# Altium schematic sheet PowerSupply.SchDoc
size A3; Organization: Altium Limited; Address1: L3, 12a Rodborough Rd; Address2: Frenchs Forest; Address3: NSW; Address4: Australia 2086
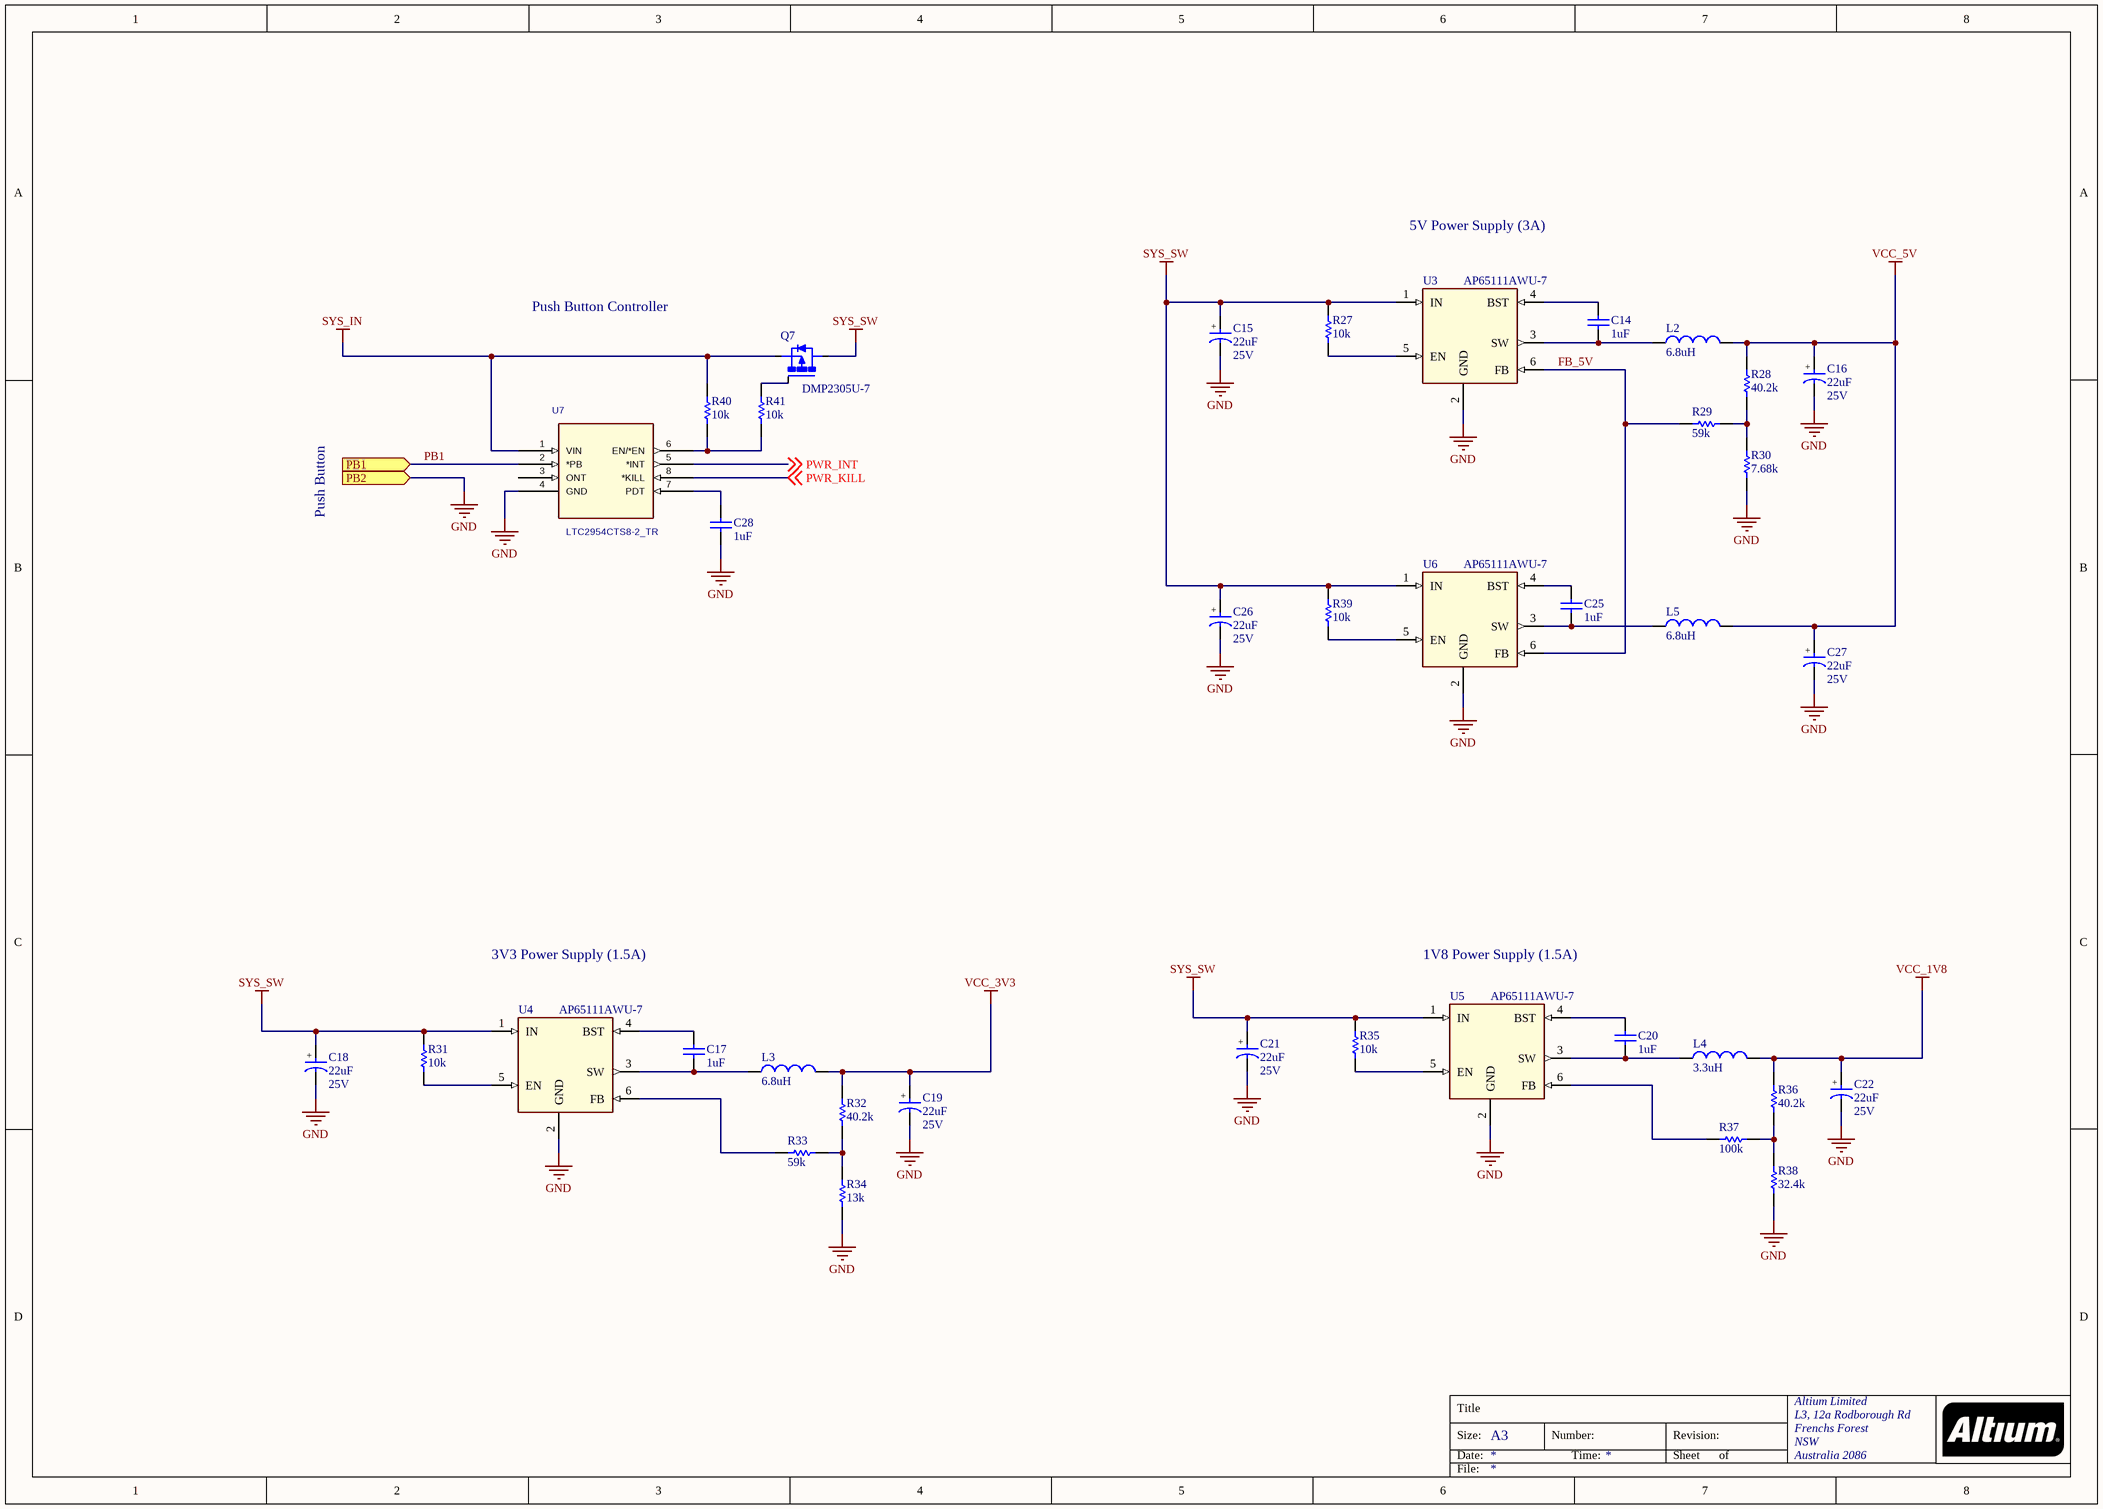
[diagram p0: PowerSupply.SchDoc]

## Parts
C14  value 1uF  [C0603]  (hidden comment: CAP)
C15  value 22uF  Voltage: 25V  [CASE-A]  (hidden comment: CAP-P)
C16  value 22uF  Voltage: 25V  [CASE-A]  (hidden comment: CAP-P)
C17  value 1uF  [C0603]  (hidden comment: CAP)
C18  value 22uF  Voltage: 25V  [CASE-A]  (hidden comment: CAP-P)
C19  value 22uF  Voltage: 25V  [CASE-A]  (hidden comment: CAP-P)
C20  value 1uF  [C0603]  (hidden comment: CAP)
C21  value 22uF  Voltage: 25V  [CASE-A]  (hidden comment: CAP-P)
C22  value 22uF  Voltage: 25V  [CASE-A]  (hidden comment: CAP-P)
C25  value 1uF  [C0603]  (hidden comment: CAP)
C26  value 22uF  Voltage: 25V  [CASE-A]  (hidden comment: CAP-P)
C27  value 22uF  Voltage: 25V  [CASE-A]  (hidden comment: CAP-P)
C28  value 1uF  [C0402]  (hidden comment: CAP)
L2  value 6.8uH  [PA4332.XXXNLT]  (hidden comment: PA4332.103NLT)
L3  value 6.8uH  [PA4332.XXXNLT]  (hidden comment: PA4332.103NLT)
L4  value 3.3uH  [PA4332.XXXNLT]  (hidden comment: PA4332.103NLT)
L5  value 6.8uH  [PA4332.XXXNLT]  (hidden comment: PA4332.103NLT)
Q7  DMP2305U-7  [SOT23-3]
R27  value 10k  [R0402]  (hidden comment: RES)
R28  value 40.2k  [R0402]  (hidden comment: RES)
R29  value 59k  [R0402]  (hidden comment: RES)
R30  value 7.68k  [R0402]  (hidden comment: RES)
R31  value 10k  [R0402]  (hidden comment: RES)
R32  value 40.2k  [R0402]  (hidden comment: RES)
R33  value 59k  [R0402]  (hidden comment: RES)
R34  value 13k  [R0402]  (hidden comment: RES)
R35  value 10k  [R0402]  (hidden comment: RES)
R36  value 40.2k  [R0402]  (hidden comment: RES)
R37  value 100k  [R0402]  (hidden comment: RES)
R38  value 32.4k  [R0402]  (hidden comment: RES)
R39  value 10k  [R0402]  (hidden comment: RES)
R40  value 10k  [R0402]  (hidden comment: RES)
R41  value 10k  [R0402]  (hidden comment: RES)
U3  AP65111AWU-7  [SOT95P280X100-6N]
U4  AP65111AWU-7  [SOT95P280X100-6N]
U5  AP65111AWU-7  [SOT95P280X100-6N]
U6  AP65111AWU-7  [SOT95P280X100-6N]
U7  LTC2954CTS8-2_TR  [TSOT-23_TS8-M]

## Ports
PB1 (in), PB2 (in)

## Nets
GND: C15.2 C16.2 C18.2 C19.2 C21.2 C22.2 C26.2 C27.2 C28.2 R30.2 R34.2 R38.2 U3.2(GND) U4.2(GND) U5.2(GND) U6.2(GND) U7.4(GND) ; port PB2
SYS_IN: Q7.2(S) R40.2 U7.1(VIN)
SYS_SW: C15.1 C18.1 C21.1 C26.1 Q7.3(D) R27.1 R31.1 R35.1 R39.1 U3.1(IN) U4.1(IN) U5.1(IN) U6.1(IN)
VCC_1V8: C22.1 L4.2 R36.1
VCC_3V3: C19.1 L3.2 R32.1
VCC_5V: C16.1 C27.1 L2.2 L5.2 R28.1
FB_5V: R29.1 U3.6(FB) U6.6(FB)
PB1: U7.2(*PB) ; port PB1
PWR_INT: U7.5(*INT) ; off-sheet PWR_INT
PWR_KILL: U7.8(*KILL) ; off-sheet PWR_KILL
NetC14_1: C14.1 U3.4(BST)
NetC14_2: C14.2 L2.1 U3.3(SW)
NetC17_1: C17.1 U4.4(BST)
NetC17_2: C17.2 L3.1 U4.3(SW)
NetC20_1: C20.1 U5.4(BST)
NetC20_2: C20.2 L4.1 U5.3(SW)
NetC25_1: C25.1 U6.4(BST)
NetC25_2: C25.2 L5.1 U6.3(SW)
NetC28_1: C28.1 U7.7(PDT)
NetQ7_1: Q7.1(G) R41.2
NetR27_2: R27.2 U3.5(EN)
NetR28_2: R28.2 R29.2 R30.1
NetR31_2: R31.2 U4.5(EN)
NetR32_2: R32.2 R33.2 R34.1
NetR33_1: R33.1 U4.6(FB)
NetR35_2: R35.2 U5.5(EN)
NetR36_2: R36.2 R37.2 R38.1
NetR37_1: R37.1 U5.6(FB)
NetR39_2: R39.2 U6.5(EN)
NetR40_1: R40.1 R41.1 U7.6(EN/*EN)

Not connected (* = marked no-connect by the designer): U7 3(ONT)

## Notes on the sheet
- 5V Power Supply (3A)
- Push Button Controller
- Push Button
- 3V3 Power Supply (1.5A)
- 1V8 Power Supply (1.5A)
- Title
- Size:
- Date:
- A3
- Number:
- Time:
- Revision:
- Sheet
- of
- File:
- (in symbol CAP-P) +

## Library data of the parts
C14 C17 C20 C25 C28 = CAP: =Description; Voltage: 25V
C15 C16 C18 C19 C21 C22 C26 C27 = CAP-P: =Description
L2 L3 L5 = IND: =Description; Part_Number: PA4332.682NLT
L4 = IND: FIXED IND 10UH 2A 216 MOHM SMD; Part_Number: PA4332.332NLT
Q7 = MOSFET_P_GSD: P Channel MOSFET, SOT23; Part_Number: DMP2305U-7
R27-R41 = RES: =Description
U3-U6 = AP65111AWU-7: Dcdc Conv Hv Buck Tsot26 t&r 3k; MF: Diodes Inc.; Digi-Key_Purchase_URL: https://www.digikey.com.au/product-detail/en/diodes-incorporated/AP65111AWU-7/AP65111AWU-7DICT-ND/7652826?utm_source=snapeda&utm_medium=aggregator&utm_campaign=symbol; MP: AP65111AWU-7; Package: TSOT-23-6 Diodes Inc.; SnapEDA_Link: https://www.snapeda.com/parts/AP65111AWU-7/Diodes%20Inc./view-part/?ref=snap; Digi-Key_Part_Number: AP65111AWU-7DICT-ND; Value: *; Part_Number: AP65111AWU-7
U7 = LTC2954CTS8-2_TR: Part_Number: LTC2954CTS8-2#TRMPBF; Vendor: Linear Technology; Built_By: EMA_UL_Team; Value: LTC2954CTS8-2_TR